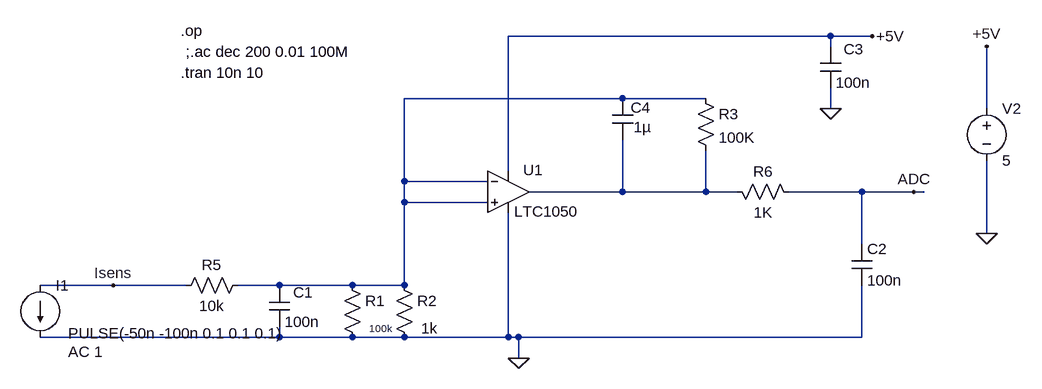
[diagram p0: schematic TPelectronique_Pierre_Laurens_Touzani.asc]
TPelectronique_Pierre_Laurens_Touzani.asc, the LTspice schematic file:
Version 4
SHEET 1 1144 680
WIRE 848 -176 352 -176
WIRE 912 -176 848 -176
WIRE 848 -160 848 -176
WIRE 528 -80 192 -80
WIRE 656 -80 528 -80
WIRE 848 -64 848 -96
WIRE 1088 -64 1088 -160
WIRE 352 32 352 -176
WIRE 192 48 192 -80
WIRE 320 48 192 48
WIRE 528 64 528 -16
WIRE 528 64 384 64
WIRE 656 64 656 0
WIRE 656 64 528 64
WIRE 704 64 656 64
WIRE 896 64 784 64
WIRE 976 64 896 64
WIRE 992 64 976 64
WIRE 192 80 192 48
WIRE 320 80 192 80
WIRE 1088 128 1088 16
WIRE 896 144 896 64
WIRE -256 208 -368 208
WIRE -144 208 -256 208
WIRE 0 208 -64 208
WIRE 112 208 0 208
WIRE 192 208 192 80
WIRE 192 208 112 208
WIRE 0 288 0 272
WIRE 0 288 -368 288
WIRE 112 288 0 288
WIRE 192 288 112 288
WIRE 352 288 352 96
WIRE 352 288 192 288
WIRE 368 288 352 288
WIRE 896 288 896 208
WIRE 896 288 368 288
WIRE 368 320 368 288
FLAG 368 320 0
FLAG 848 -64 0
FLAG 976 64 ADC
FLAG 1088 128 0
FLAG 1088 -160 +5V
FLAG -256 208 Isens
FLAG 912 -176 +5V
SYMBOL Opamps\\LTC1050 352 0 R0
WINDOW 0 23 30 Left 2
WINDOW 3 9 94 Left 2
SYMATTR InstName U1
SYMBOL res -48 192 R90
WINDOW 0 0 56 VBottom 2
WINDOW 3 32 56 VTop 2
SYMATTR InstName R5
SYMATTR Value 10k
SYMBOL res 96 192 R0
WINDOW 3 42 82 Left 1
SYMATTR Value 100k
SYMATTR InstName R1
SYMBOL res 176 192 R0
WINDOW 3 42 82 Left 2
SYMATTR Value 1k
SYMATTR InstName R2
SYMBOL cap -16 208 R0
WINDOW 0 37 11 Left 2
SYMATTR InstName C1
SYMATTR Value 100n
SYMBOL cap 512 -80 R0
WINDOW 0 28 14 Left 2
WINDOW 3 33 44 Left 2
SYMATTR InstName C4
SYMATTR Value 1µ
SYMBOL res 640 -96 R0
SYMATTR InstName R3
SYMATTR Value 100K
SYMBOL cap 832 -160 R0
WINDOW 0 36 4 Left 2
SYMATTR InstName C3
SYMATTR Value 100n
SYMBOL res 688 48 M90
WINDOW 0 0 56 VBottom 2
WINDOW 3 32 56 VTop 2
SYMATTR InstName R6
SYMATTR Value 1K
SYMBOL cap 880 144 R0
SYMATTR InstName C2
SYMATTR Value 100n
SYMBOL voltage 1088 -80 R0
WINDOW 123 0 0 Left 0
WINDOW 39 0 0 Left 0
SYMATTR InstName V2
SYMATTR Value 5
SYMBOL current -368 208 R0
WINDOW 3 43 74 Left 2
WINDOW 123 43 102 Left 2
WINDOW 39 0 0 Left 0
SYMATTR Value PULSE(-50n -100n 0.1 0.1 0.1)
SYMATTR Value2 AC 1
SYMATTR InstName I1
TEXT -152 -120 Left 2 !.tran 10n 10
TEXT -152 -184 Left 2 !.op
TEXT -144 -152 Left 2 !;.ac dec 200 0.01 100M

The netlist it stands for:
* TPelectronique_Pierre_Laurens_Touzani.asc
XU1 N001 N001 +5V 0 N002 LTC1050  ; pins In+ In- V+ V- OUT
R5 N001 Isens 10k
R1 N001 0 100k
R2 N001 0 1k
C1 N001 0 100n
C4 N001 N002 1µ
R3 N001 N002 100K
C3 +5V 0 100n
R6 N002 ADC 1K
C2 ADC 0 100n
V2 +5V 0 5
I1 Isens 0 PULSE(-50n -100n 0.1 0.1 0.1) AC 1
.tran 10n 10
.op
;.ac dec 200 0.01 100M
.lib LTC.lib
.backanno
.end